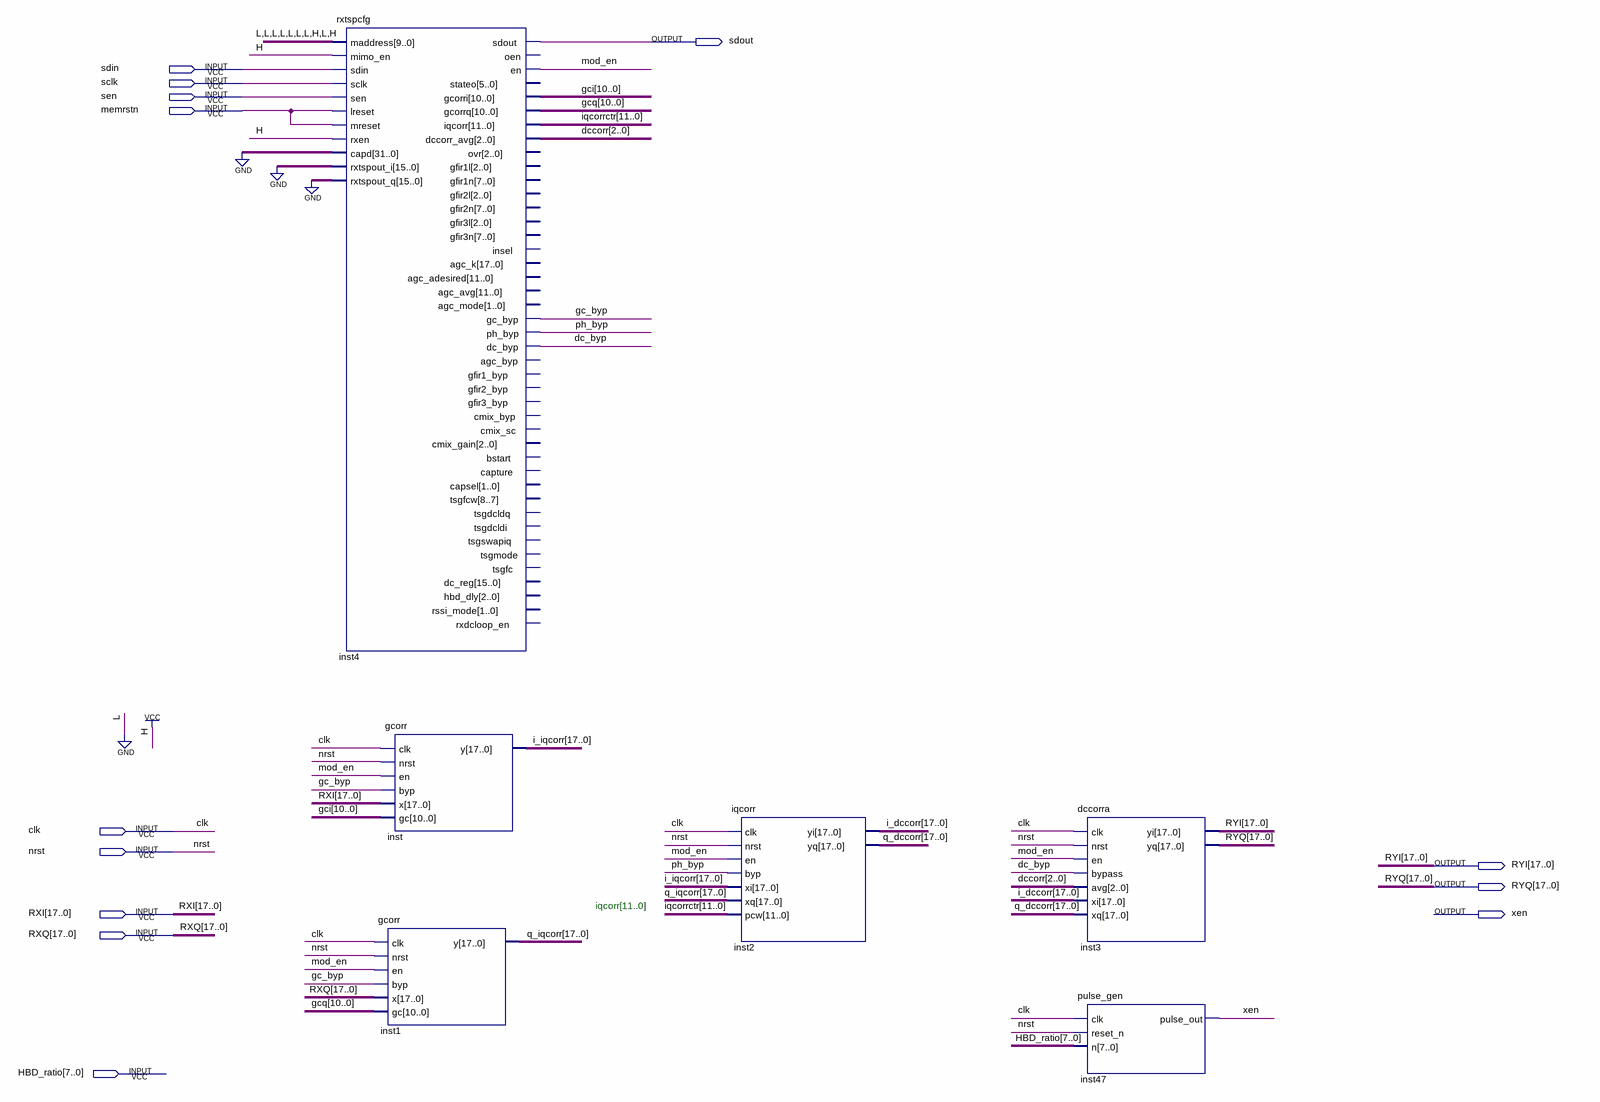
[diagram p0: schematic sheet]
// Quartus schematic rx_chain.bdf as structural Verilog: 6 symbols, 13 pins
module rx_chain (
  input  sdin,
  input  sclk,
  input  sen,
  input  memrstn,
  input  clk,
  input  nrst,
  input  [17:0] RXI,
  input  [17:0] RXQ,
  input  [7:0] HBD_ratio,
  output sdout,
  output [17:0] RYI,
  output [17:0] RYQ,
  output xen
);

  wire dc_byp, gc_byp, mod_en, ph_byp;
  wire [2:0] dccorr;
  wire [10:0] gci, gcq;
  wire [11:0] iqcorrctr;
  wire [17:0] i_dccorr, i_iqcorr, q_dccorr, q_iqcorr;

  rxtspcfg inst4 (
    .maddress(10'b0000000101), .mimo_en(1'b1), .sdin(sdin), .sclk(sclk), .sen(sen), .lreset(memrstn),
    .mreset(memrstn), .rxen(1'b1), .capd({32{1'b0}}), .rxtspout_i({16{1'b0}}), .rxtspout_q({16{1'b0}}),
    .sdout(sdout), .en(mod_en), .gcorri(gci), .gcorrq(gcq), .iqcorr(iqcorrctr), .dccorr_avg(dccorr),
    .gc_byp(gc_byp), .ph_byp(ph_byp), .dc_byp(dc_byp));  // open: oen, stateo, ovr, gfir1l, gfir1n, gfir2l, gfir2n, gfir3l, gfir3n, insel, agc_k, agc_adesired, agc_avg, agc_mode, agc_byp, gfir1_byp, gfir2_byp, gfir3_byp, cmix_byp, cmix_sc, cmix_gain, bstart, capture, capsel, tsgfcw, tsgdcldq, tsgdcldi, tsgswapiq, tsgmode, tsgfc, dc_reg, hbd_dly, rssi_mode, rxdcloop_en
  gcorr inst (.clk(clk), .nrst(nrst), .en(mod_en), .byp(gc_byp), .x(RXI), .gc(gci), .y(i_iqcorr));
  gcorr inst1 (.clk(clk), .nrst(nrst), .en(mod_en), .byp(gc_byp), .x(RXQ), .gc(gcq), .y(q_iqcorr));
  iqcorr inst2 (
    .clk(clk), .nrst(nrst), .en(mod_en), .byp(ph_byp), .xi(i_iqcorr), .xq(q_iqcorr), .pcw(iqcorrctr),
    .yi(i_dccorr), .yq(q_dccorr));
  dccorra inst3 (
    .clk(clk), .nrst(nrst), .en(mod_en), .bypass(dc_byp), .avg(dccorr), .xi(i_dccorr), .xq(q_dccorr),
    .yi(RYI), .yq(RYQ));
  pulse_gen inst47 (.clk(clk), .reset_n(nrst), .n(HBD_ratio), .pulse_out(xen));

  // Notes on the sheet:
  //   iqcorr[11..0]
endmodule
